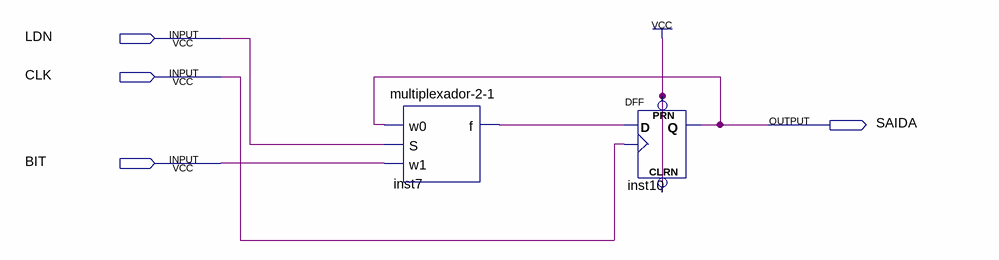
[diagram p0: schematic sheet]
// Quartus schematic memoria1bit.bdf as structural Verilog: 2 symbols, 4 pins
module memoria1bit (
  input  LDN,
  input  CLK,
  input  BIT,
  output SAIDA
);

  wire inst7_f;

  \multiplexador-2-1  inst7 (.w0(SAIDA), .S(LDN), .w1(BIT), .f(inst7_f));
  DFF inst10 (.CLRN(1'b1), .CLK(CLK), .D(inst7_f), .PRN(1'b1), .Q(SAIDA));
endmodule
